# Altium schematic sheet Panel Mode Switch.SchDoc: Panel Mode Switch
size A4; ApprovedBy: LD Stanton; Author: LD Stanton; CompanyName: University of Cape Town; DrawnBy: Lawrence Stanton; Engineer: Lawrence Stanton; Organization: University of Cape Town; Address1: Department of Electrical Engineering; Address2: Rondebosch; Address3: Cape Town; Address4: South Africa 7701; DocumentNumber: 7; SheetNumber: 7; SheetTotal: 20
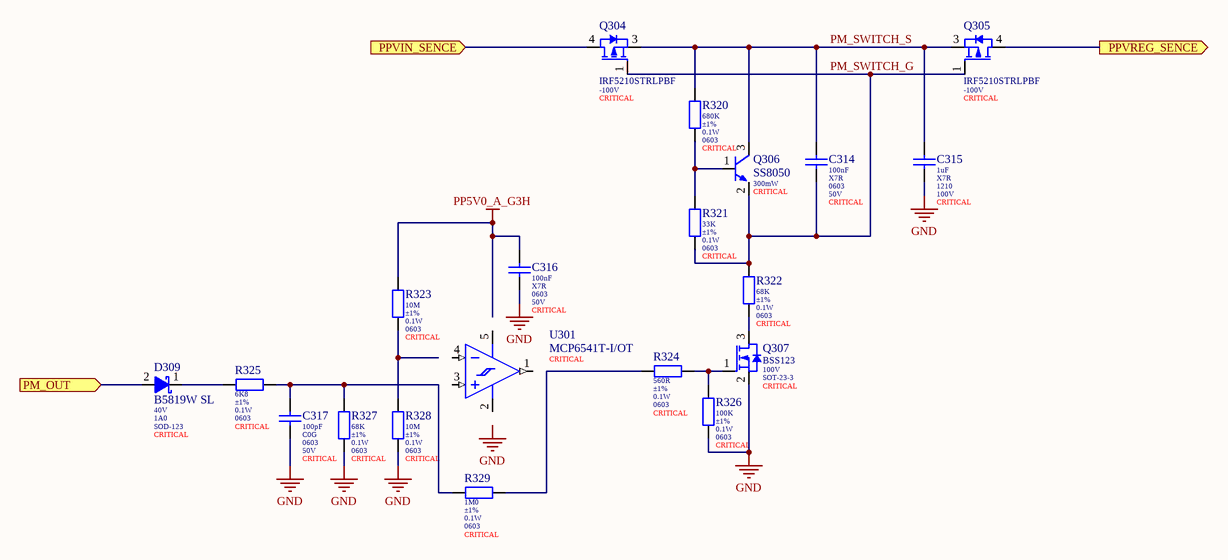
[diagram p0: Panel Mode Switch.SchDoc]

## Parts
C314  value 100nF  Dielectric: X7R  Package: 0603  Voltage: 50V  Populate: CRITICAL  [0603 (Yageo DA) B]  (hidden comment: CC0603KRX7R9BB104)
C315  value 1uF  Dielectric: X7R  Package: 1210  Voltage: 100V  Populate: CRITICAL  [1212_250_J (Samsumg) B]  (hidden comment: CL32B105KCJNNNE)
C316  value 100nF  Dielectric: X7R  Package: 0603  Voltage: 50V  Populate: CRITICAL  [0603 (Yageo DA) B]  (hidden comment: CC0603KRX7R9BB104)
C317  value 100pF  Dielectric: C0G  Package: 0603  Voltage: 50V  Populate: CRITICAL  [0603_080_8 (Samsung) B]  (hidden comment: CL10C101JB8NNNC)
D309  B5819W SL  Blocking Voltage: 40V  Forward Current: 1A0  Package: SOD-123  Placement: CRITICAL  [SOD-123 (JCET) B]
Q304  IRF5210STRLPBF  Maximum Drain Source Voltage: -100V  Placement: CRITICAL  [D2PAC (IRF5210) B]
Q305  IRF5210STRLPBF  Maximum Drain Source Voltage: -100V  Placement: CRITICAL  [D2PAC (IRF5210) B]
Q306  SS8050  Power: 300mW  Placement: CRITICAL  [SOT-23-5 (SS8050) B]
Q307  BSS123  Maximum Drain Source Voltage: 100V  Package: SOT-23-3  Placement: CRITICAL  [SOT-23-3 (2N7002) B]
R320  value 680K  Tolerance: ±1%  Power: 0.1W  Package: 0603  Populate: CRITICAL  [0603 (Uniroyal) B]  (hidden comment: 0603WAF6803T5E)
R321  value 33K  Tolerance: ±1%  Power: 0.1W  Package: 0603  Populate: CRITICAL  [0603 (Uniroyal) B]  (hidden comment: 0603WAF3302T5E)
R322  value 68K  Tolerance: ±1%  Power: 0.1W  Package: 0603  Populate: CRITICAL  [0603 (Uniroyal) B]  (hidden comment: 0603WAF6802T5E)
R323  value 10M  Tolerance: ±1%  Power: 0.1W  Package: 0603  Populate: CRITICAL  [0603 (Uniroyal) B]  (hidden comment: 0603WAF1005T5E)
R324  value 560R  Tolerance: ±1%  Power: 0.1W  Package: 0603  Populate: CRITICAL  [0603 (Uniroyal) B]  (hidden comment: 0603WAF5600T5E)
R325  value 6K8  Tolerance: ±1%  Power: 0.1W  Package: 0603  Populate: CRITICAL  [0603 (Uniroyal) B]  (hidden comment: 0603WAF6801T5E)
R326  value 100K  Tolerance: ±1%  Power: 0.1W  Package: 0603  Populate: CRITICAL  [0603 (Uniroyal) B]  (hidden comment: 0603WAF1003T5E)
R327  value 68K  Tolerance: ±1%  Power: 0.1W  Package: 0603  Populate: CRITICAL  [0603 (Uniroyal) B]  (hidden comment: 0603WAF6802T5E)
R328  value 10M  Tolerance: ±1%  Power: 0.1W  Package: 0603  Populate: CRITICAL  [0603 (Uniroyal) B]  (hidden comment: 0603WAF1005T5E)
R329  value 1M0  Tolerance: ±1%  Power: 0.1W  Package: 0603  Populate: CRITICAL  [0603 (Uniroyal) B]  (hidden comment: 0603WAF1004T5E)
U301  MCP6541T-I/OT  Placement: CRITICAL  [SOT-23-5 (MCP75x) B]

## Ports
PM_OUT (in), PPVIN_SENCE (in), PPVREG_SENCE (out)

## Nets
GND: C315.2 C316.2 C317.2 Q307.2(S) R326.2 R327.2 R328.2
PP5V0_A_G3H: C316.1 R323.1
PM_OUT: D309.2(A) ; port PM_OUT
PM_SWITCH_G: C314.2 Q304.1(G) Q305.1(G) Q306.2(E) R321.2 R322.1
PM_SWITCH_S: C314.1 C315.1 Q304.3(S) Q305.3(S) Q306.3(C) R320.1
PPVIN_SENCE: Q304.4(D) ; port PPVIN_SENCE
PPVREG_SENCE: Q305.4(D) ; port PPVREG_SENCE
NetC317_1: C317.1 R325.1 R327.1 R329.1
NetD309_1: D309.1(K) R325.2
NetQ306_1: Q306.1(B) R320.2 R321.1
NetQ307_1: Q307.1(G) R324.2 R326.1
NetQ307_3: Q307.3(D) R322.2
NetR323_2: R323.2 R328.1
NetR324_1: R324.1 R329.2

Not connected (* = marked no-connect by the designer): U301 1(OUT) 2(VSS) 3(VIN+) 4(VIN-) 5(VDD)

## Notes on the sheet
- Labels drawn without touching a wire or pin: GND
- Size:
- Date:
- A4
- Number:
- Time:
- Revision:
- Sheet
- of
- File:
- Author:

## Library data of the parts
C314 C316 = CMP-047-000000-7: MLCC 100nF 50V 0603 X7R ±10%; Manufacturer: Yageo; LCSC Part Number: C14663; Tolerance: ±10%; ComponentLink1URL: https://datasheet.lcsc.com/szlcsc/YAGEO-CC0603KRX7R9BB104_C14663.pdf; ComponentLink1Description: Datasheet
C315 = CMP-014-000009-3: MLCC 1uF 1210 100V X7R ±10%; Manufacturer: Samsung; ComponentLink1Description: Datasheet; Tolerance: ±10%; LCSC Part Number: C444847; ComponentLink1URL: https://datasheet.lcsc.com/szlcsc/Samsung-Electro-Mechanics-CL05C100JB5NNNC_C32949.pdf
C317 = CMP-045-000015-8: MLCC 100pF 0603 50V C0G ±0.1pF; Manufacturer: Samsung; ComponentLink1Description: Datasheet; LCSC Part Number: C14858; ComponentLink1URL: https://datasheet.lcsc.com/szlcsc/Samsung-Electro-Mechanics-CL05C100JB5NNNC_C32949.pdf; Tolerance: ±0.1pF
D309 = CMP-022-000009-2: Schottky Barrier Diode 40V 1A 600mV SOD-123 JCET; ComponentLink1URL: https://datasheet.lcsc.com/lcsc/1809140216_Changjiang-Electronics-Tech--CJ-B5819W-SL_C8598.pdf; LCSC Part Number: C8598; ComponentLink1Description: Datasheet
Q304 Q305 = CMP-040-000011-3: MOSFET P-Channel 100V 38A 3-Pin (2+Tab) D2PAK; Drain to Source Resistance: 60mR; Power Dissipation: 3.1W; Gate to Source Voltage (Vgs): 20V; Threshold Voltage: -4V; Min Operating Temperature: -55°C; Case/Package: D2PAK; Continuous Drain Current (ID): 38A; ComponentLink1Description: Datasheet; LCSC Part Number: C2622; RoHS Compliant: Yes; Polarity: P-CHANNEL; ComponentLink1URL: https://datasheet.lcsc.com/lcsc/1809201934_Infineon-Technologies-IRF5210STRLPBF_C2622.pdf; Rds On Max: 60mR; Max Operating Temperature: 150°C
Q306 = CMP-040-000005-4: BJT NPN 1A5 25V SOT-23-3; Manufacturer: Changjiang Electronics; Collector Emitter Saturation Voltage: 0V5; DC Gain: 120-400; Maximum Collector Emitter Voltage: 25V; ComponentLink1Description: Datasheet; Pin Count: 3; Component Type: Standard; ComponentLink1URL: https://datasheet.lcsc.com/lcsc/1809211023_Changjiang-Electronics-Tech--CJ-SS8050-G_C164886.pdf; Source: BJTs.SchLib; Maximum Collector Current: 1A5; LCSC Part Number: C2150
Q307 = CMP-040-000009-11: Small Signal MOSFET, 170mA, 100V, N-Channel, Enhancement, JCET SOT-23-3; Maximum Gate Source Voltage: ±20V; Power: 0.35W; Maximum Drain Current: 0.17A; Gate Threshold Voltage: 2V8; Drain-Source On Resistance: 10R; ComponentLink1Description: Datasheet; Manufacturer: JCET; ComponentLink1URL: https://datasheet.lcsc.com/lcsc/1809211016_Changjiang-Electronics-Tech--CJ-BSS123_C79015.pdf; LCSC Part Number: C79015
R320 = CMP-010-000364-3: Resistor 680K 0603 ±1% Thick Film Uniroyal; Temperature Coefficient: ±100ppm/K; Working Voltage: 75V; Manufacturer: Uniroyal; LCSC Part Number: C25822; ComponentLink1Description: Datasheet; Temperature: -55 - 155°C; ComponentLink1URL: https://datasheet.lcsc.com/szlcsc/1811062009_UNI-ROYAL-Uniroyal-Elec-0603WAF1002T5E_C25804.pdf; Pin Count: 2
R321 = CMP-010-000332-10: Resistor 33K 0603 ±1% Thick Film Uniroyal; Working Voltage: 75V; Temperature Coefficient: ±100ppm/K; Temperature: -55 - 155°C; ComponentLink1URL: https://datasheet.lcsc.com/szlcsc/1811062009_UNI-ROYAL-Uniroyal-Elec-0603WAF1002T5E_C25804.pdf; Manufacturer: Uniroyal; LCSC Part Number: C4216; ComponentLink1Description: Datasheet; Pin Count: 2
R322 R327 = CMP-010-000350-9: Resistor 68K 0603 ±1% Thick Film Uniroyal; Working Voltage: 75V; Temperature Coefficient: ±100ppm/K; Manufacturer: Uniroyal; ComponentLink1Description: Datasheet; Temperature: -55 - 155°C; ComponentLink1URL: https://datasheet.lcsc.com/szlcsc/1811062009_UNI-ROYAL-Uniroyal-Elec-0603WAF1002T5E_C25804.pdf; Pin Count: 2; LCSC Part Number: C23231
R323 R328 = CMP-010-000294-9: Resistor 10M 0603 ±1% Thick Film Uniroyal; Working Voltage: 75V; Temperature Coefficient: ±200ppm/K; Temperature: -55 - 155°C; Pin Count: 2; ComponentLink1URL: https://datasheet.lcsc.com/szlcsc/1811062009_UNI-ROYAL-Uniroyal-Elec-0603WAF1002T5E_C25804.pdf; Manufacturer: Uniroyal; LCSC Part Number: C7250; ComponentLink1Description: Datasheet
R324 = CMP-010-000387-3: Resistor 560R 0603 ±1% Thick Film Uniroyal; Working Voltage: 75V; Temperature Coefficient: ±200ppm/K; Pin Count: 2; Manufacturer: Uniroyal; ComponentLink1Description: Datasheet; Temperature: -55 - 155°C; ComponentLink1URL: https://datasheet.lcsc.com/szlcsc/1811062009_UNI-ROYAL-Uniroyal-Elec-0603WAF1002T5E_C25804.pdf; LCSC Part Number: C23204
R325 = CMP-010-000384-2: Resistor 6K8 0603 ±1% Thick Film Uniroyal; Temperature Coefficient: ±100ppm/K; Working Voltage: 75V; ComponentLink1URL: https://datasheet.lcsc.com/szlcsc/1811062009_UNI-ROYAL-Uniroyal-Elec-0603WAF1002T5E_C25804.pdf; ComponentLink1Description: Datasheet; Pin Count: 2; Temperature: -55 - 155°C; Manufacturer: Uniroyal; LCSC Part Number: C23212
R326 = CMP-010-000288-10: Resistor 100K 0603 ±1% Thick Film Uniroyal; Working Voltage: 75V; Temperature Coefficient: ±100ppm/K; Manufacturer: Uniroyal; ComponentLink1URL: https://datasheet.lcsc.com/szlcsc/1811062009_UNI-ROYAL-Uniroyal-Elec-0603WAF1002T5E_C25804.pdf; LCSC Part Number: C25803; Temperature: -55 - 155°C; ComponentLink1Description: Datasheet; Pin Count: 2
R329 = CMP-010-000313-12: Resistor 1M0 0603 ±1% Thick Film Uniroyal; Working Voltage: 75V; Temperature Coefficient: ±100ppm/K; Manufacturer: Uniroyal; Pin Count: 2; LCSC Part Number: C22935; Temperature: -55 - 155°C; ComponentLink1Description: Datasheet; ComponentLink1URL: https://datasheet.lcsc.com/szlcsc/1811062009_UNI-ROYAL-Uniroyal-Elec-0603WAF1002T5E_C25804.pdf
U301 = CMP-000025-4: Comparator, Push-Pull, 1V6-5V5, 600nA,  SOT-23-5; Min Supply Voltage: 1.6V; Max Supply Voltage: 5.5V; Propagation Delay: 8us; Quiescent Current: 1uA; Nominal Supply Current: 1mA; Input Bias Current: 1pA; Input Offset Voltage (Vos): 7mV; Hysteresis: 6.5mV; Output Current: 2mA; Package: SOT-23-5; ComponentLink1Description: Datasheet; Output Type: Push-Pull; Min Operating Temperature: -40°C; RoHS: Yes; Max Operating Temperature: 85°C; ComponentLink1URL: https://ww1.microchip.com/downloads/en/DeviceDoc/MCP6541%20Output%20SubMicroamp%20Comparators%2020001696K.pdf; LCSC Part Number: C80839